# EAGLE design Cub (EAGLE 7.2.0)
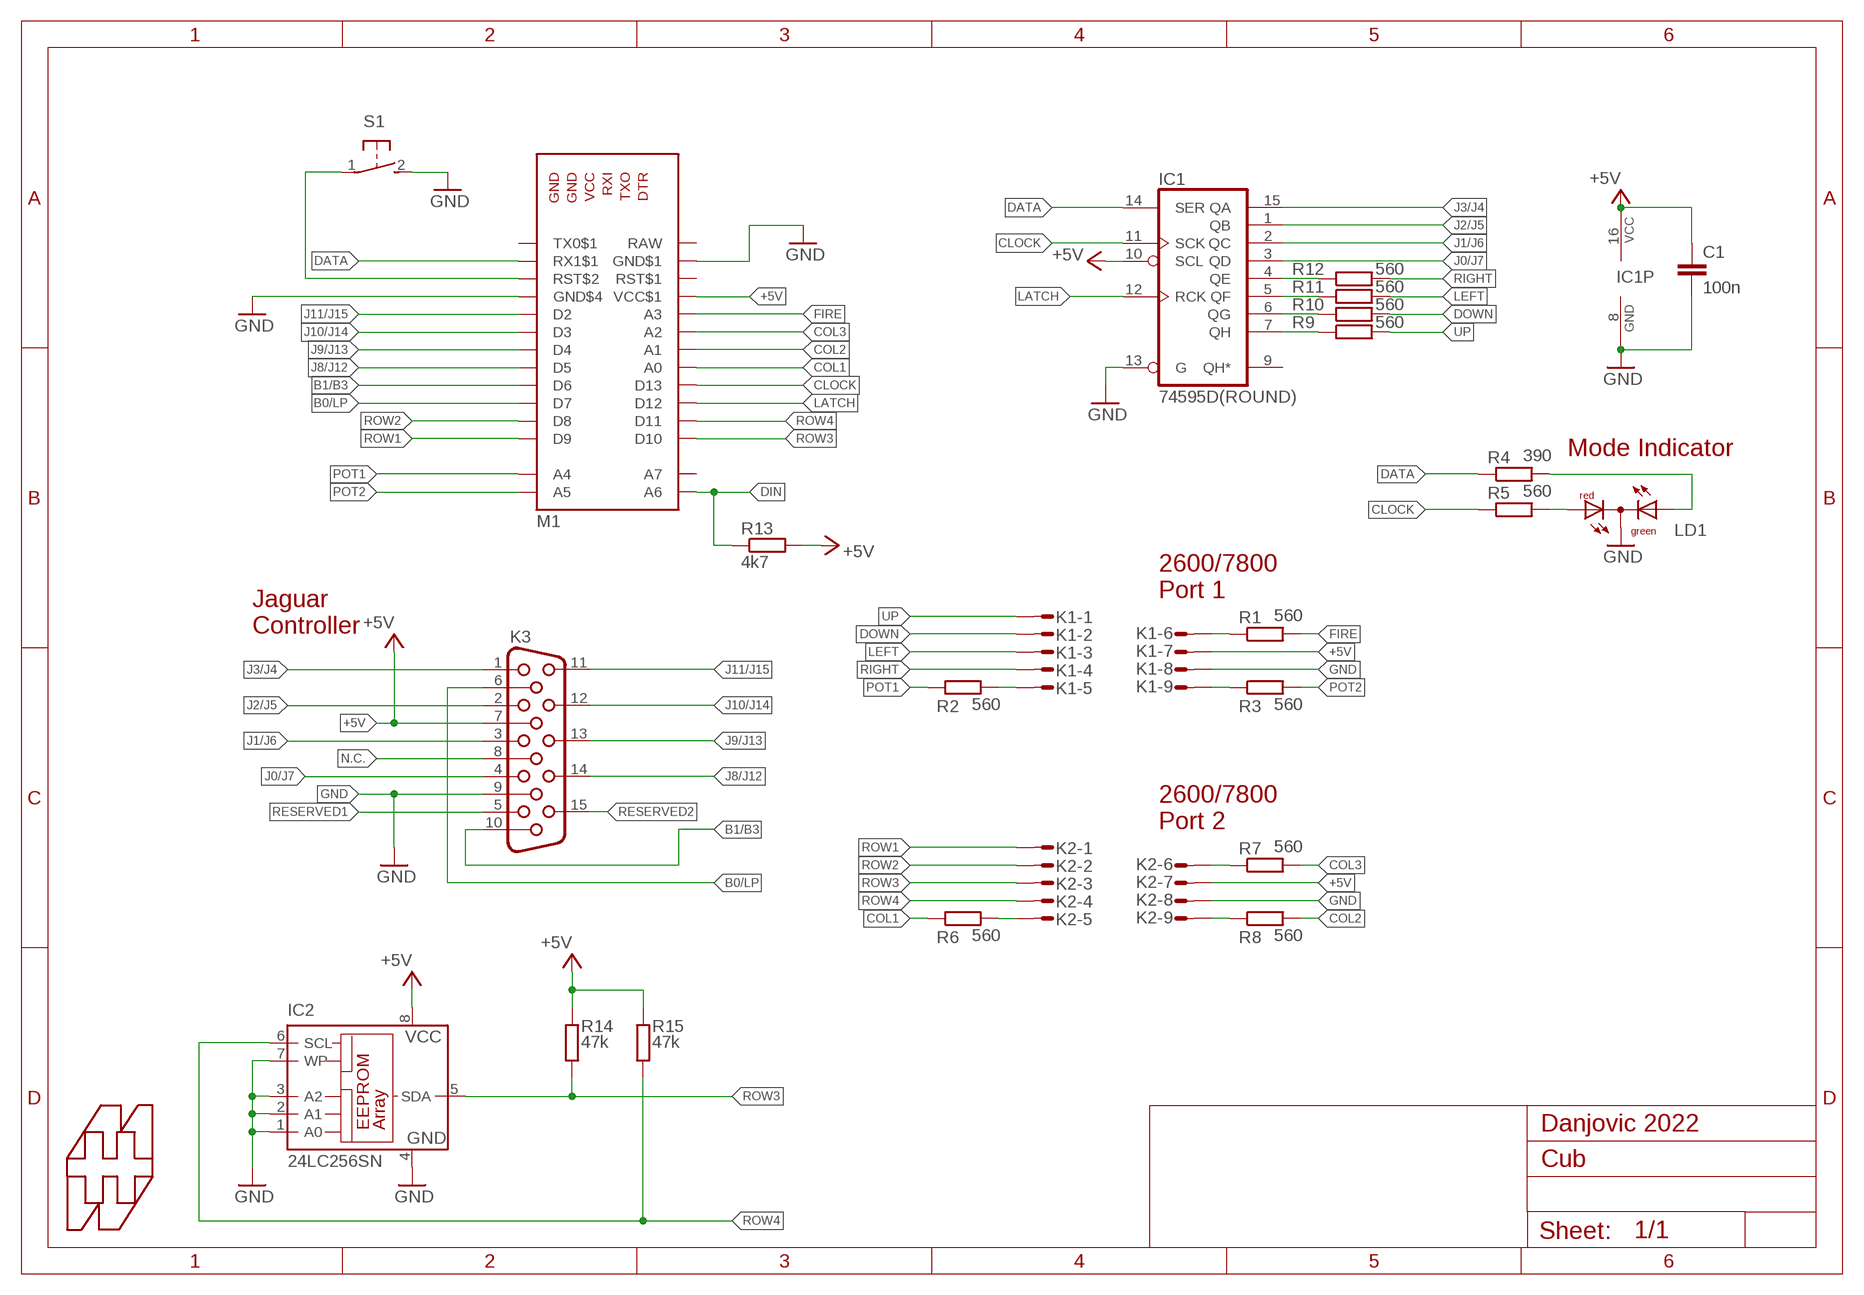
[diagram p0: schematic, sheet 1]

## Parts
C1  100n  C-EU050-024X044  [C050-024X044]
IC1  74595D(ROUND)  [DIL16-ROUND]
IC2  24LC256SN  [SO-08]
K1  S09P  [S09P]
K2  S09P  [S09P]
K3  HF15H  [HDF15H]
LD1  DUOLED-RG-C  [DUOLED-C-5MM]
M1  ARDUINO_PRO_MINI_SIDE_ONLY  [ARDUNIO_PRO_MINI_SIDE_ONLY]
R1  560  R-EU_0204/7  [0204/7]
R2  560  R-EU_0204/7  [0204/7]
R3  560  R-EU_0204/7  [0204/7]
R4  390  R-EU_0204/7  [0204/7]
R5  560  R-EU_0204/7  [0204/7]
R6  560  R-EU_0204/7  [0204/7]
R7  560  R-EU_0204/7  [0204/7]
R8  560  R-EU_0204/7  [0204/7]
R9  560  R-EU_0204/7  [0204/7]
R10  560  R-EU_0204/7  [0204/7]
R11  560  R-EU_0204/7  [0204/7]
R12  560  R-EU_0204/7  [0204/7]
R13  4k7  R-EU_0204/7  [0204/7]
R14  47k  R-EU_0204/7  [0204/7]
R15  47k  R-EU_0204/7  [0204/7]
S1  31-XX  [B3F-31XX]
U$1  HAMMOND-1593J  [1593J]

## Nets
!RESET: M1.RST$2 S1.1(P)
+5V: C1.1 IC1.10(SCL) IC1.16(VCC) IC2.8(VCC) K1.7 K2.7 K3.7 M1.VCC$1 R13.2 R14.2 R15.2
B0/LP: K3.6 M1.D7
B1/B3: K3.10 M1.D6
CLOCK: IC1.11(SCK) M1.D13 R5.1
COL1: M1.A0 R6.1
COL2: M1.A1 R8.2
COL3: M1.A2 R7.2
DATA: IC1.14(SER) M1.RX1$1 R4.1
DIN: M1.A6 R13.1
DOWN: K1.2 R10.2
FIRE: M1.A3 R1.2
GND: C1.2 IC1.8(GND) IC1.13(G) IC2.1(A0) IC2.2(A1) IC2.3(A2) IC2.4(GND) IC2.7(WP) K1.8 K2.8 K3.9 LD1.C M1.GDN$1(GND$1) M1.GND$4 S1.2(S)
J0/J7: IC1.3(QD) K3.4
J1/J6: IC1.2(QC) K3.3
J2/J5: IC1.1(QB) K3.2
J3/J4: IC1.15(QA) K3.1
J8/J12: K3.14 M1.D5
J9/J13: K3.13 M1.D4
J10/J14: K3.12 M1.D3
J11/J15: K3.11 M1.D2
LATCH: IC1.12(RCK) M1.D12
LD-GRN: LD1.AX(AG) R4.2
LD-RD: LD1.AR R5.2
LEFT: K1.3 R11.2
N.C.: K3.8
POT1: M1.A4 R2.1
POT2: M1.A5 R3.2
R_COL1: K2.5 R6.2
R_COL2: K2.9 R8.1
R_COL3: K2.6 R7.1
R_DOWN: IC1.6(QG) R10.1
R_FIRE: K1.6 R1.1
R_LEFT: IC1.5(QF) R11.1
R_POT1: K1.5 R2.2
R_POT2: K1.9 R3.1
R_RIGHT: IC1.4(QE) R12.1
R_UP: IC1.7(QH) R9.1
RESERVED1: K3.5
RESERVED2: K3.15
RIGHT: K1.4 R12.2
ROW1: K2.1 M1.D9
ROW2: K2.2 M1.D8
ROW3: IC2.5(SDA) K2.3 M1.D10 R14.1
ROW4: IC2.6(SCL) K2.4 M1.D11 R15.1
UP: K1.1 R9.2
Unconnected: IC1.9(QH*) M1.A7 M1.RST$1 M1.TX0$1

## Notes on the sheet
- Mode Indicator
- 2600/7800
  Port 1
- Jaguar
  Controller
- 2600/7800
  Port 2
- Danjovic 2022

## Power pins joined to a net without a drawn wire
RAW: M1.RAW

## Library data of the parts
C1 = rcl:C-EU: CAPACITOR, European symbol
IC1 = 74xx-us:74*595: 8-bit SHIFT REGISTER, output latch
IC2 = microchip:24*: Serial EEPROM I2C; MF: MICROCHIP; MPN: 24LC256-I/SN; OC_FARNELL: 9757996; OC_NEWARK: 27C9144
K1 K2 = con-amp-mt:S09P: AMP MT CONNECTOR; OC_FARNELL: unknown; OC_NEWARK: unknown
K3 = con-subd:HF15: SUB-D; OC_FARNELL: unknown; OC_NEWARK: unknown
LD1 = led:DUOLED-RG-C: DUO LED 2 colors (red/green), 5 mm, round, common Cathode www.ligitek.com or other producers.
M1 = Digistump:ARDUINO_PRO_MINI_SIDE_ONLY
R1-R15 = rcl:R-EU_: RESISTOR, European symbol
S1 = switch-omron:31-XX: OMRON SWITCH; MPN: B3F-3100; OC_FARNELL: 959704; OC_NEWARK: 36M3582
U$1 = box-hammond:HAMMOND-

## Board
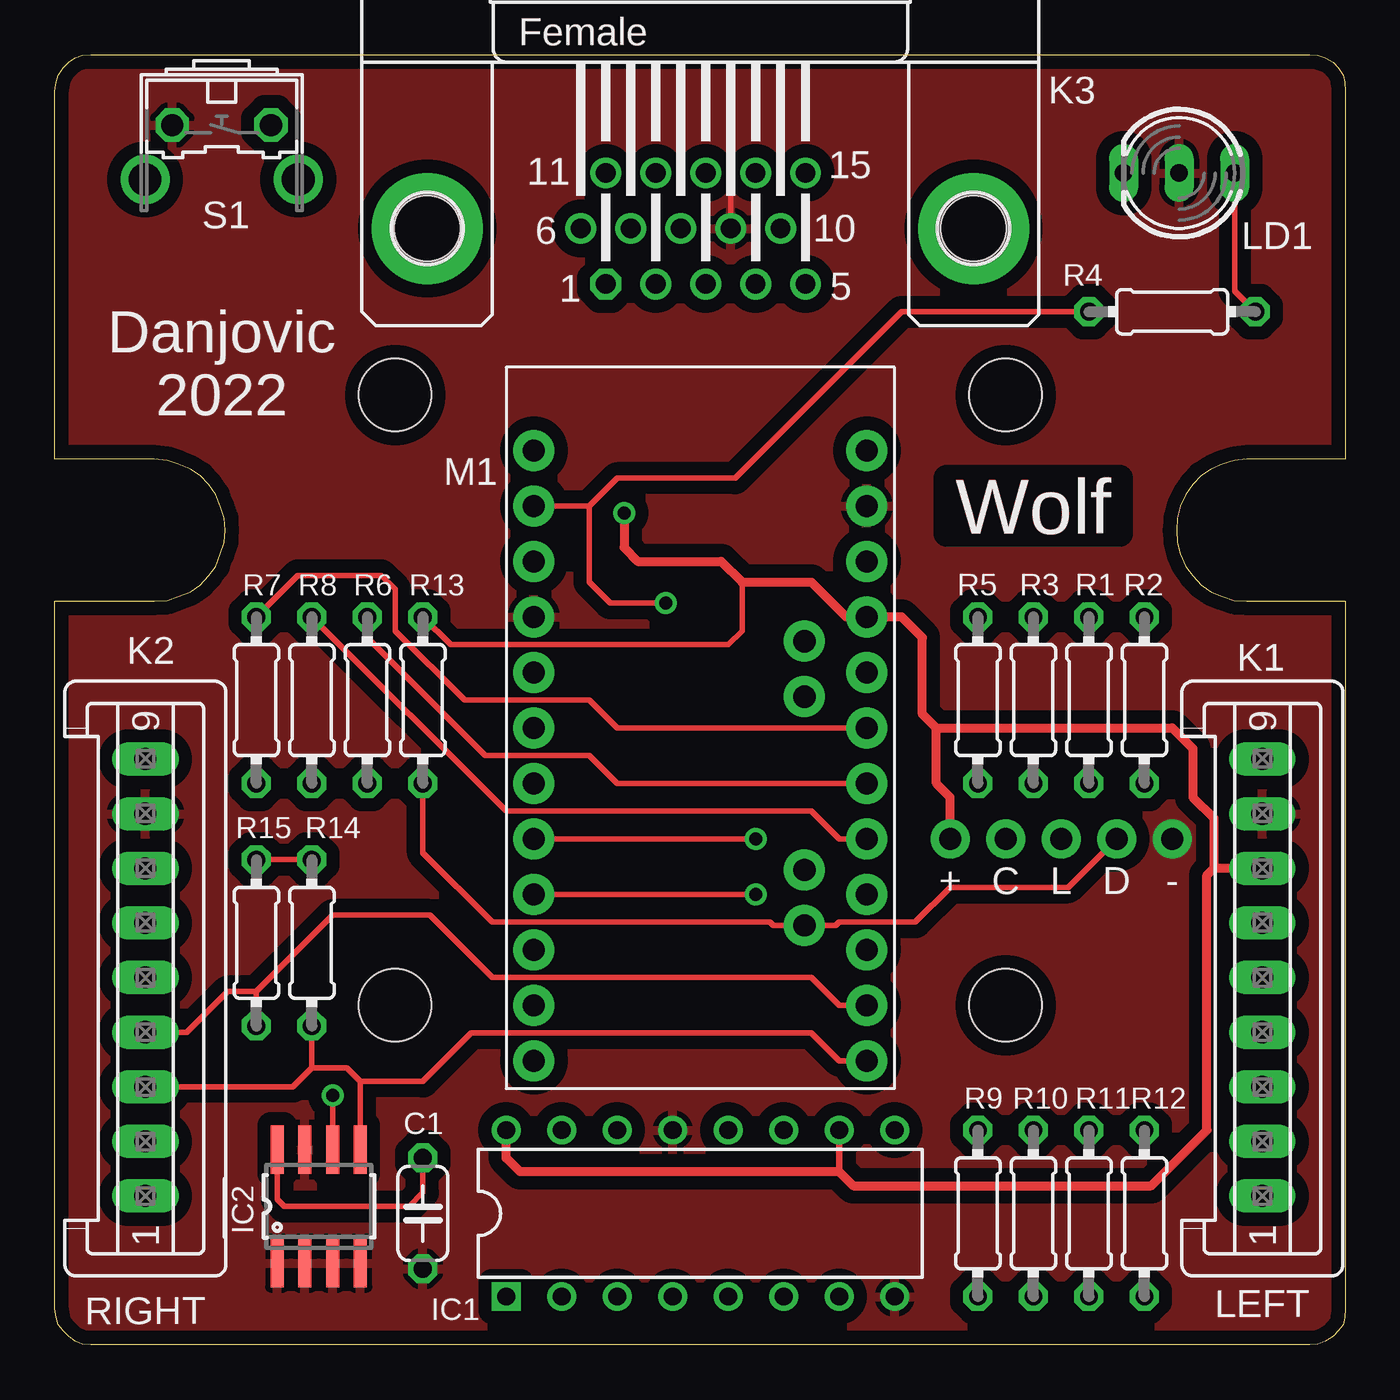
[diagram p1: board, top side]
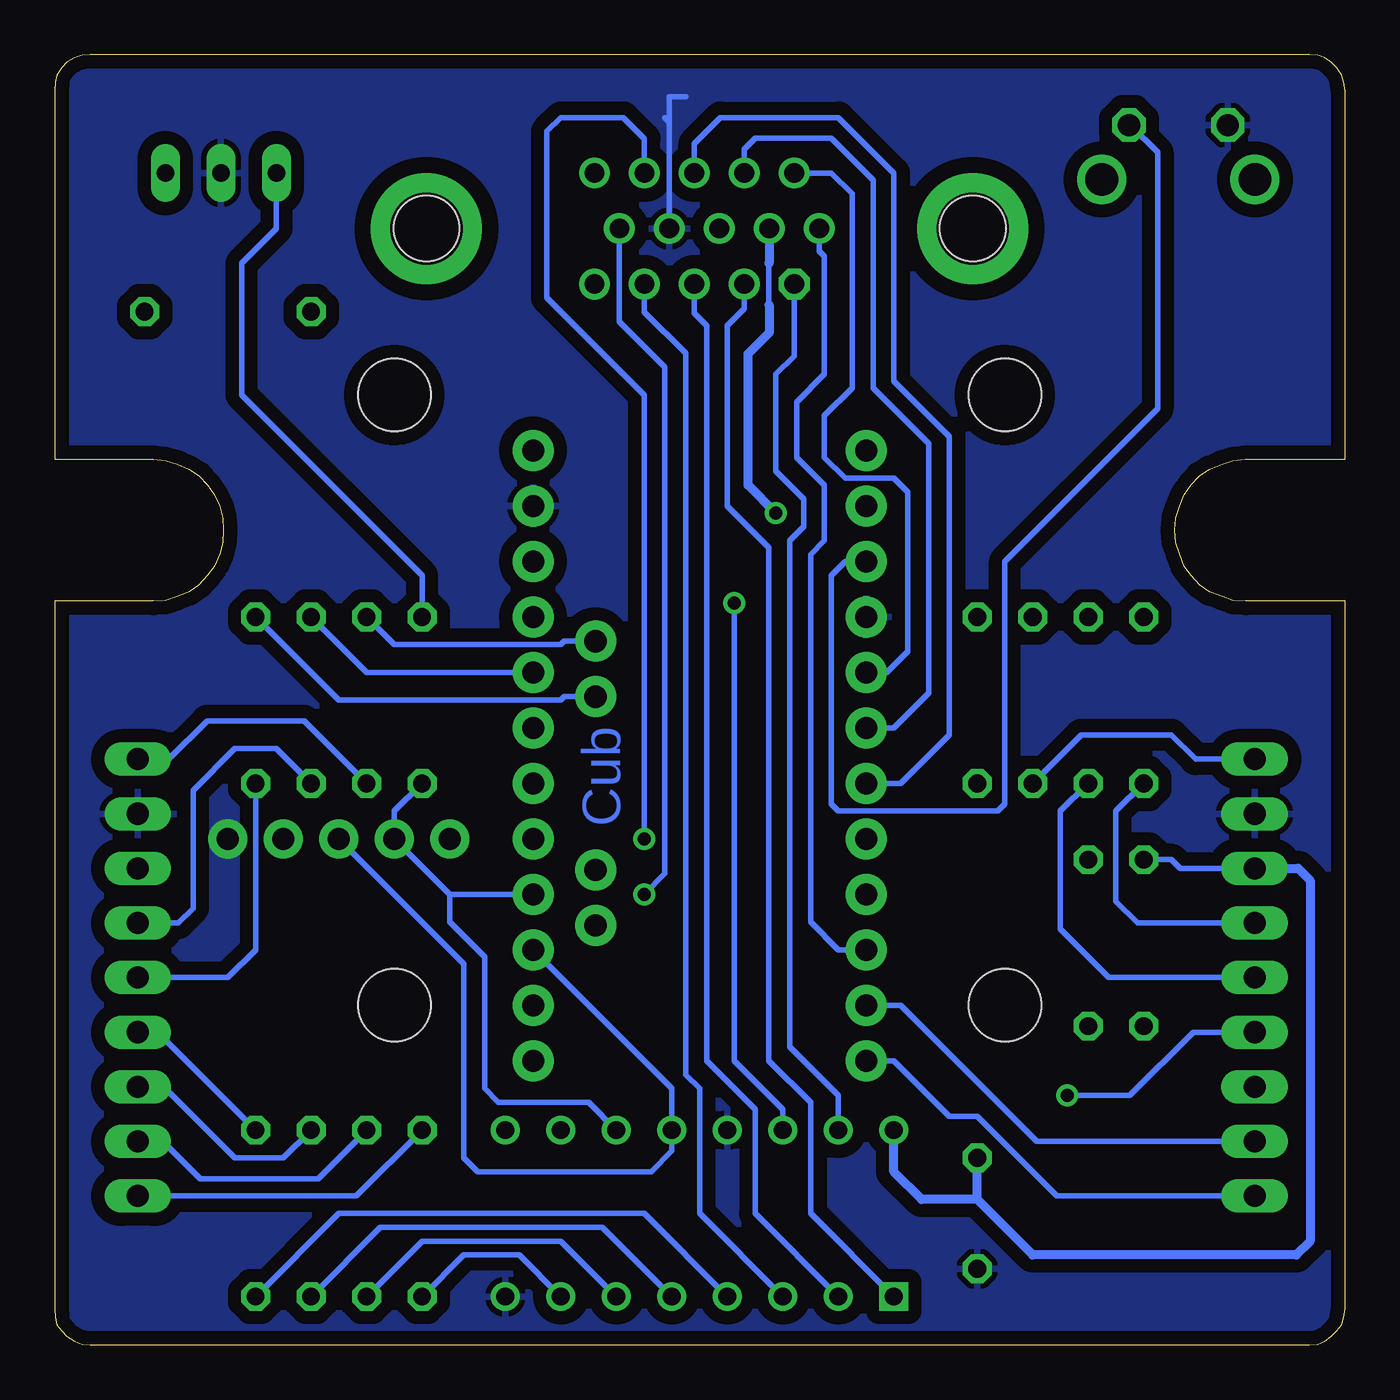
[diagram p2: board, bottom side, seen from below]

Size 59.07 x 59.07 mm. Coordinates in mm from the lower left corner, seen from the top.
Copper layers (1*16): Top 0.035mm / dielectric 1.5mm / Bottom 0.035mm
Design rules "default *": minimum track width 10mil, minimum drill 24mil, track to track 8mil, track to pad 8mil, pad to pad 8mil, via to via 8mil, smd to smd 8mil, copper to edge 25mil, drill to drill 8mil, minimum pad ring 10mil, minimum via ring 8mil, stop-mask expansion 4mil, vias tented up to drill 0mil, thermal gap 10mil

### Footprints (pad centres in the part's own frame; a part is rotated, then mirrored left to right if it is on the bottom)
C050-024X044 = drill 0.813 octagon: 1 -2.54,0; 2 2.54,0
DIL16-ROUND = drill 0.813 square: 1 -8.89,-3.81 | drill 0.813: 2 -6.35,-3.81; 3 -3.81,-3.81; 4 -1.27,-3.81; 5 1.27,-3.81; 6 3.81,-3.81; 7 6.35,-3.81; 8 8.89,-3.81; 9 8.89,3.81; 10 6.35,3.81; 11 3.81,3.81; 12 1.27,3.81; 13 -1.27,3.81; 14 -3.81,3.81; 15 -6.35,3.81; 16 -8.89,3.81
SO-08 = smd 0.6 x 2.2: 1 -1.905,-2.6; 2 -0.635,-2.6; 3 0.635,-2.6; 4 1.905,-2.6; 5 1.905,2.6; 6 0.635,2.6; 7 -0.635,2.6; 8 -1.905,2.6
S09P = drill 1.016 long: 1 10,0; 2 7.5,0; 3 5,0; 4 2.5,0; 5 0,0; 6 -2.5,0; 7 -5,0; 8 -7.5,0; 9 -10,0
HDF15H = drill 0.9 octagon: 1 4.329,2.54 | drill 0.9: 2 2.043,2.54; 3 -0.243,2.54; 4 -2.529,2.54; 5 -4.815,2.54; 6 5.472,0; 7 3.186,0; 8 0.9,0; 9 -1.386,0; 10 -3.672,0; 11 4.329,-2.54; 12 2.043,-2.54; 13 -0.243,-2.54; 14 -2.529,-2.54; 15 -4.815,-2.54 | drill 3.302 pad 5.08: G1 -12.5,0; G2 12.5,0 | hole 3: -12.5,0; 12.5,0
DUOLED-C-5MM = drill 0.813 long: AR 2.54,0; AX -2.54,0; C 0,0
ARDUNIO_PRO_MINI_SIDE_ONLY = drill 1.016 pad 1.88: A0 7.62,-5.08; A1 7.62,-2.54; A2 7.62,0; A3 7.62,2.54; A4 4.763,1.429; A5 4.763,3.969; A6 4.763,-9.049; A7 4.763,-6.509; D2 -7.62,2.54; D3 -7.62,0; D4 -7.62,-2.54; D5 -7.62,-5.08; D6 -7.62,-7.62; D7 -7.62,-10.16; D8 -7.62,-12.7; D9 -7.62,-15.24; D10 7.62,-15.24; D11 7.62,-12.7; D12 7.62,-10.16; D13 7.62,-7.62; GDN$1 7.62,10.16; GND$4 -7.62,5.08; RAW 7.62,12.7; RST$1 7.62,7.62; RST$2 -7.62,7.62; RX1$1 -7.62,10.16; TX0$1 -7.62,12.7; VCC$1 7.62,5.08
0204/7 = drill 0.813 octagon: 1 -3.81,0; 2 3.81,0
B3F-31XX = drill 1.016 octagon: 1 -2.261,-1.245; 2 2.261,-1.245 | drill 1.499 pad 2.159: 3 -3.505,1.245; 4 3.505,1.245
1593J = hole 3.302: -13.97,-13.97; 13.97,-13.97; -13.97,13.97; 13.97,13.97

### Placement (x,y rotation side)
C1  16.85,6.02 270 top
IC1  29.55,6.02 0 top
IC2  12.09,6.34 0 top
K1  55.27,16.82 270 top
K2  4.15,16.82 270 top
K3  29.55,51.11 180 top
LD1  51.46,53.65 180 top
M1  29.55,28.25 0 top
R1  47.33,29.52 90 top
R2  49.87,29.52 270 top
R3  44.79,29.52 90 top
R4  51.14,47.3 0 top
R5  42.25,29.52 90 top
R6  11.77,29.52 270 top
R7  9.23,29.52 90 top
R8  14.31,29.52 90 top
R9  42.25,6.02 90 top
R10  44.79,6.02 90 top
R11  47.33,6.02 90 top
R12  49.87,6.02 90 top
R13  16.85,29.52 90 top
R14  11.77,18.41 90 top
R15  9.23,18.41 90 top
S1  7.65,54.6 180 top
U$1  29.55,29.52 180 top

### Tracks (layer width: path | path; a pad name or v marks a point on that pad's centre or on a via)
!RESET
  Bottom 0.254: S1.1 9.84,55.84 8.6,54.6 8.6,42.85 15.58,35.87 15.58,24.76 15.9,24.44 23.2,24.44 23.52,24.76 23.52,35.23 22.88,35.87 M1.RST$2
+5V  (via drill 0.6, 1 pad 1.78)
  Top 0.254: IC2.8 10.19,6.66 10.5,6.34 16.22,6.34 16.85,6.98 C1.1 | R15.2 R14.2 | R13.2 18.12,32.06 30.82,32.06 31.46,32.69 31.46,34.91
  Top 0.305: IC1.10 35.9,7.93
  Top 0.406: v26.06,38.09 26.06,36.5 26.69,35.87 30.51,35.87 31.46,34.91 34.63,34.91 36.22,33.33 M1.VCC$1 38.76,33.33 39.71,32.37 39.71,28.88 40.35,28.25 | IC1.16 20.66,8.56 21.3,7.93 35.9,7.93 36.54,7.29 50.19,7.29 52.73,9.83 52.73,21.5 53.05,21.82 | K1.7 53.05,21.82 | v40.98,23.17 40.98,25.07 40.35,25.71 40.35,28.25 | 40.35,28.25 51.14,28.25 52.1,27.3 52.1,25.07 53.05,24.12 53.05,21.82
  Bottom 0.254: 26.38,49.52 26.38,47.62 26.37,47.6 | K2.7 7.56,21.82 7.96,22.21 R15.2
  Bottom 0.406: 16.85,6.66 19.39,6.66 20.66,7.93 IC1.16 | K2.7 2.17,21.82 1.61,21.26 1.61,4.75 2.25,4.12 14.31,4.12 16.85,6.66 | 16.85,6.66 C1.1 | v26.06,38.09 27.33,39.36 27.33,45.37 26.37,46.33 26.37,47.6 | K3.7 26.37,49.53 26.38,49.52
B0/LP
  Bottom 0.254: M1.D7 23.2,18.09 24.47,19.36 24.47,36.19 23.84,36.82 23.84,39.36 25.11,40.63 25.11,43.17 23.84,44.44 23.84,49.84 24.08,50.08 K3.6
B1/B3  (via drill 0.6)
  Top 0.254: M1.D6 v32.09,20.63
  Bottom 0.254: K3.10 33.22,46.84 31.14,44.76 31.14,21.58 v32.09,20.63
CLOCK  (via drill 1 pad 1.78)
  Bottom 0.254: R5.1 43.52,24.44 v43.52,23.17 40.98,20.63 | 40.98,20.63 M1.D13 36.85,20.63 | IC1.11 34.63,11.1 38.76,11.1 39.39,11.74 39.39,17.77 40.98,19.36 40.98,20.63
COL1
  Top 0.254: M1.A0 35.9,23.17 34.63,24.44 20.66,24.44 R6.1
COL2
  Top 0.254: M1.A1 25.74,25.71 24.47,26.98 19.71,26.98 14.31,32.37 R8.2
COL3
  Top 0.254: M1.A2 25.74,28.25 24.47,29.52 18.76,29.52 15.58,32.69 15.58,34.6 14.95,35.23 11.14,35.23 R7.2
DATA  (via drill 0.6)
  Top 0.254: R4.1 38.76,47.3 31.14,39.68 25.74,39.68 24.47,38.41 | M1.RX1$1 24.47,38.41 | 24.47,38.41 24.47,34.91 25.42,33.96 v27.96,33.96
  Bottom 0.254: IC1.14 25.74,10.79 27.96,13.01 v27.96,33.96
DIN  (via drill 1 pad 1.78)
  Top 0.254: v48.6,23.17 46.38,20.94 40.98,20.94 39.39,19.36 35.9,19.36 35.74,19.2 M1.A6 32.89,19.2 32.73,19.36 20.03,19.36 16.85,22.53 R13.1
DOWN
  Bottom 0.254: K1.2 54.12,9.32 52.41,7.61 47.02,7.61 R10.2
FIRE
  Bottom 0.254: M1.A3 44.79,30.79 46.38,32.37 R1.2
GND  (via drill 1 pad 1.78)
  Top 0.254: K3.9 30.94,55.99
  Bottom 0.254: 30.94,55.99 31.14,56.19 | K3.9 30.94,57.14 30.19,57.14
  other vias: 51.14,23.17
  pour Bottom (isolate 0.61): 60.03,59.36 60.03,-0.96 -0.93,-0.96 -0.93,59.36
  pour Top (isolate 0.61): 60.03,59.36 60.03,-1.6 -0.93,-0.33 -0.93,59.36
J0/J7
  Bottom 0.254: IC1.3 29.55,6.02 29.55,11.74 30.19,12.37 30.19,45.39 32.08,47.29 K3.4
J1/J6
  Bottom 0.254: IC1.2 27.01,6.02 27.01,10.79 29.24,13.01 29.24,46.66 29.8,47.22 K3.3
J2/J5
  Bottom 0.254: IC1.1 24.47,6.02 24.47,11.1 26.38,13.01 26.38,36.5 28.28,38.41 28.28,46.66 27.51,47.44 K3.2
J3/J4
  Bottom 0.254: IC1.15 23.2,11.42 25.42,13.64 25.42,36.82 24.79,37.45 24.79,38.73 26.06,40 26.06,44.44 25.22,45.28 K3.1
J8/J12  (via drill 0.6)
  Top 0.254: M1.D5 v32.09,23.17
  Bottom 0.254: K3.14 32.08,55.22 33.04,56.19 35.9,56.19 36.54,55.55 36.54,47.93 32.09,43.49 v32.09,23.17
J9/J13
  Bottom 0.254: K3.13 29.8,54.99 28.6,56.19 23.2,56.19 20.66,53.65 20.66,44.12 18.12,41.58 18.12,27.93 20.35,25.71 M1.D4
J10/J14
  Bottom 0.254: K3.12 27.51,54.74 27.01,55.23 23.52,55.23 21.62,53.33 21.62,43.8 19.08,41.26 19.08,29.83 20.66,28.25 M1.D3
J11/J15
  Bottom 0.254: K3.11 23.52,53.65 22.57,52.69 22.57,43.8 23.84,42.54 23.84,40.63 22.88,39.68 20.66,39.68 20.03,39.04 20.03,31.74 20.98,30.79 M1.D2
LATCH  (via drill 1 pad 1.78)
  Bottom 0.254: M1.D12 30.82,11.74 IC1.12 30.82,8.88 31.78,7.93 39.71,7.93 40.35,8.56 40.35,17.45 v46.06,23.17
LD-GRN
  Top 0.254: LD1.AX 54,48.25 R4.2
LD-RD
  Bottom 0.254: LD1.AR 48.92,51.11 50.51,49.52 50.51,43.49 42.25,35.23 R5.2
LEFT
  Bottom 0.254: K1.3 54.08,11.82 50.82,8.56 48.6,8.56 R11.2
POT1
  Bottom 0.254: M1.A4 35.74,29.68 35.9,29.52 46.06,29.52 R2.1
POT2
  Bottom 0.254: M1.A5 35.74,32.22 35.9,32.06 43.21,32.06 43.52,32.06 R3.2
R_COL1
  Bottom 0.254: R6.2 13.04,24.44 13.04,19.04 10.82,16.82 K2.5
R_COL2
  Bottom 0.254: K2.9 6.85,26.82 7.96,27.93 12.09,27.93 R8.1
R_COL3
  Bottom 0.254: K2.6 9.51,19.32 10.5,20.31 10.5,23.17 10.5,24.44 R7.1
R_DOWN
  Bottom 0.254: R10.1 42.25,4.75 35.9,4.75 IC1.6
R_FIRE
  Bottom 0.254: R1.1 48.92,27.3 50.82,27.3 52.73,25.39 52.73,19.99 53.41,19.32 K1.6
R_LEFT
  Bottom 0.254: R11.1 44.16,5.39 34,5.39 IC1.5
R_POT1
  Bottom 0.254: R2.2 49.87,18.09 51.14,16.82 K1.5
R_POT2
  Bottom 0.254: R3.1 47.65,28.56 52.1,28.56 53.84,26.82 K1.9
R_RIGHT
  Bottom 0.254: R12.1 46.06,6.02 32.09,6.02 IC1.4
R_UP
  Bottom 0.254: IC1.7 37.81,4.12 40.35,4.12 R9.1
RIGHT
  Bottom 0.254: K1.4 54.36,14.32 R12.2
ROW1
  Bottom 0.254: M1.D9 20.66,13.01 18.12,10.47 16.85,10.47 13.2,6.82 K2.1
ROW2
  Bottom 0.254: M1.D8 20.35,15.55 14.12,9.32 K2.2
ROW3
  Top 0.254: M1.D10 35.9,13.01 34.63,14.28 19.08,14.28 16.85,12.06 13.99,12.06 | K2.3 10.9,11.82 11.77,12.69 | R14.1 11.77,12.69 | IC2.5 13.99,12.06 | 13.99,12.06 13.36,12.69 11.77,12.69
ROW4  (via drill 0.6)
  Top 0.254: M1.D11 35.9,15.55 34.63,16.82 20.03,16.82 17.17,19.67 12.72,19.67 9.23,16.18 | K2.4 6.06,14.32 7.92,16.18 9.23,16.18 | R15.1 9.23,16.18 | v12.72,11.42 IC2.6
  Bottom 0.254: K2.4 6.97,14.32 9.87,11.42 v12.72,11.42
UP
  Bottom 0.254: K1.1 45.27,6.82 R9.2

### Text on the board
Top: Wolf
Bottom: Cub
tPlace: Danjovic / 2022 | Wolf | + | C | L | D | - | RIGHT | LEFT